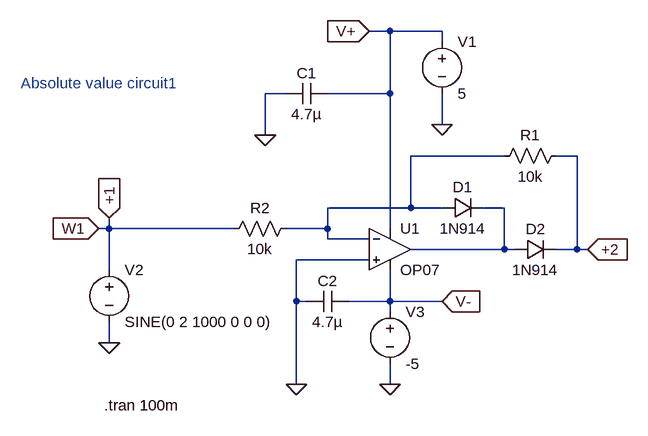
[diagram p0: schematic abs_value_cir1.asc]
abs_value_cir1.asc, the LTspice schematic file:
Version 4
SHEET 1 880 680
WIRE 288 0 256 0
WIRE 368 0 288 0
WIRE 368 16 368 0
WIRE 128 96 96 96
WIRE 288 96 288 0
WIRE 288 96 192 96
WIRE 368 144 368 96
WIRE 96 160 96 96
WIRE 464 192 320 192
WIRE 576 192 544 192
WIRE 320 272 320 192
WIRE 320 272 192 272
WIRE 368 272 320 272
WIRE 464 272 432 272
WIRE -144 304 -144 288
WIRE -144 304 -160 304
WIRE 48 304 -144 304
WIRE 192 304 192 272
WIRE 192 304 128 304
WIRE 288 304 288 96
WIRE 192 320 192 304
WIRE 256 320 192 320
WIRE 464 336 464 272
WIRE 464 336 320 336
WIRE 480 336 464 336
WIRE 576 336 576 192
WIRE 576 336 544 336
WIRE 592 336 576 336
WIRE 256 352 144 352
WIRE -144 368 -144 304
WIRE 144 416 144 352
WIRE 160 416 144 416
WIRE 288 416 288 368
WIRE 288 416 224 416
WIRE 368 416 288 416
WIRE 288 432 288 416
WIRE -144 480 -144 448
WIRE 144 544 144 416
WIRE 288 544 288 512
FLAG 368 144 0
FLAG 96 160 0
FLAG -144 480 0
FLAG 288 544 0
FLAG 144 544 0
FLAG -160 304 W1
IOPIN -160 304 In
FLAG -144 288 +1
IOPIN -144 288 In
FLAG 256 0 V+
IOPIN 256 0 In
FLAG 592 336 +2
IOPIN 592 336 In
FLAG 368 416 V-
IOPIN 368 416 In
SYMBOL voltage 368 0 R0
WINDOW 123 0 0 Left 0
WINDOW 39 0 0 Left 0
SYMATTR InstName V1
SYMATTR Value 5
SYMBOL Opamps\\OP07 288 272 R0
SYMATTR InstName U1
SYMBOL cap 192 80 R90
WINDOW 0 0 32 VBottom 2
WINDOW 3 32 32 VTop 2
SYMATTR InstName C1
SYMATTR Value 4.7µ
SYMBOL diode 368 288 R270
WINDOW 0 32 32 VTop 2
WINDOW 3 0 32 VBottom 2
SYMATTR InstName D1
SYMATTR Value 1N914
SYMBOL res 560 176 R90
WINDOW 0 0 56 VBottom 2
WINDOW 3 32 56 VTop 2
SYMATTR InstName R1
SYMATTR Value 10k
SYMBOL res 144 288 R90
WINDOW 0 0 56 VBottom 2
WINDOW 3 32 56 VTop 2
SYMATTR InstName R2
SYMATTR Value 10k
SYMBOL voltage -144 352 R0
WINDOW 123 0 0 Left 0
WINDOW 39 0 0 Left 0
SYMATTR InstName V2
SYMATTR Value SINE(0 2 1000 0 0 0)
SYMBOL voltage 288 416 R0
WINDOW 123 0 0 Left 0
WINDOW 39 0 0 Left 0
SYMATTR InstName V3
SYMATTR Value -5
SYMBOL cap 224 400 R90
WINDOW 0 0 32 VBottom 2
WINDOW 3 32 32 VTop 2
SYMATTR InstName C2
SYMATTR Value 4.7µ
SYMBOL diode 480 320 M90
WINDOW 0 0 32 VBottom 2
WINDOW 3 32 32 VTop 2
SYMATTR InstName D2
SYMATTR Value 1N914
TEXT -280 80 Left 2 ;Absolute value circuit1
TEXT -152 576 Left 2 !.tran 100m

The netlist it stands for:
* abs_value_cir1.asc
V1 V+ 0 5
XU1 0 N001 V+ V- N002 LT1001  ; OP07, pins In+ In- V+ V- OUT
C1 V+ 0 4.7µ
D1 N001 N002 1N914
R1 +2 N001 10k
R2 N001 +1 10k
V2 +1 0 SINE(0 2 1000 0 0 0)
V3 V- 0 -5
C2 V- 0 4.7µ
D2 N002 +2 1N914
.model D D
.lib standard.dio
* Absolute value circuit1
.tran 100m
.lib LTC.lib
.backanno
.end